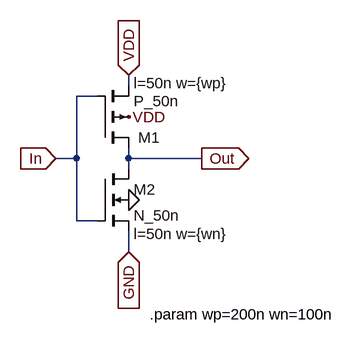
[diagram p0: schematic inv1.asc]
inv1.asc, the LTspice schematic file:
Version 4
SHEET 1 880 680
WIRE -448 0 -448 -16
WIRE -496 16 -528 16
WIRE -528 112 -528 16
WIRE -528 112 -560 112
WIRE -448 112 -448 96
WIRE -336 112 -448 112
WIRE -448 128 -448 112
WIRE -528 208 -528 112
WIRE -496 208 -528 208
WIRE -448 256 -448 224
FLAG -448 48 VDD
FLAG -448 176 0
FLAG -448 -16 VDD
IOPIN -448 -16 In
FLAG -336 112 Out
IOPIN -336 112 Out
FLAG -560 112 In
IOPIN -560 112 In
FLAG -448 256 GND
IOPIN -448 256 In
SYMBOL pmos4 -496 96 M180
WINDOW 0 63 16 Left 0
WINDOW 123 56 100 Left 0
SYMATTR InstName M1
SYMATTR Value2 l=50n w={wp}
SYMATTR Value P_50n
SYMBOL nmos4 -496 128 R0
WINDOW 123 56 100 Left 0
SYMATTR Value2 l=50n w={wn}
SYMATTR InstName M2
SYMATTR Value N_50n
TEXT -416 352 Left 0 !.param wp=200n wn=100n

The netlist it stands for:
* inv1.asc
M1 Out In VDD VDD P_50n l=50n w={wp}
M2 Out In GND 0 N_50n l=50n w={wn}
.model NMOS NMOS
.model PMOS PMOS
.lib standard.mos
.param wp=200n wn=100n
.backanno
.end